# EAGLE design Register (EAGLE 9.4.2)
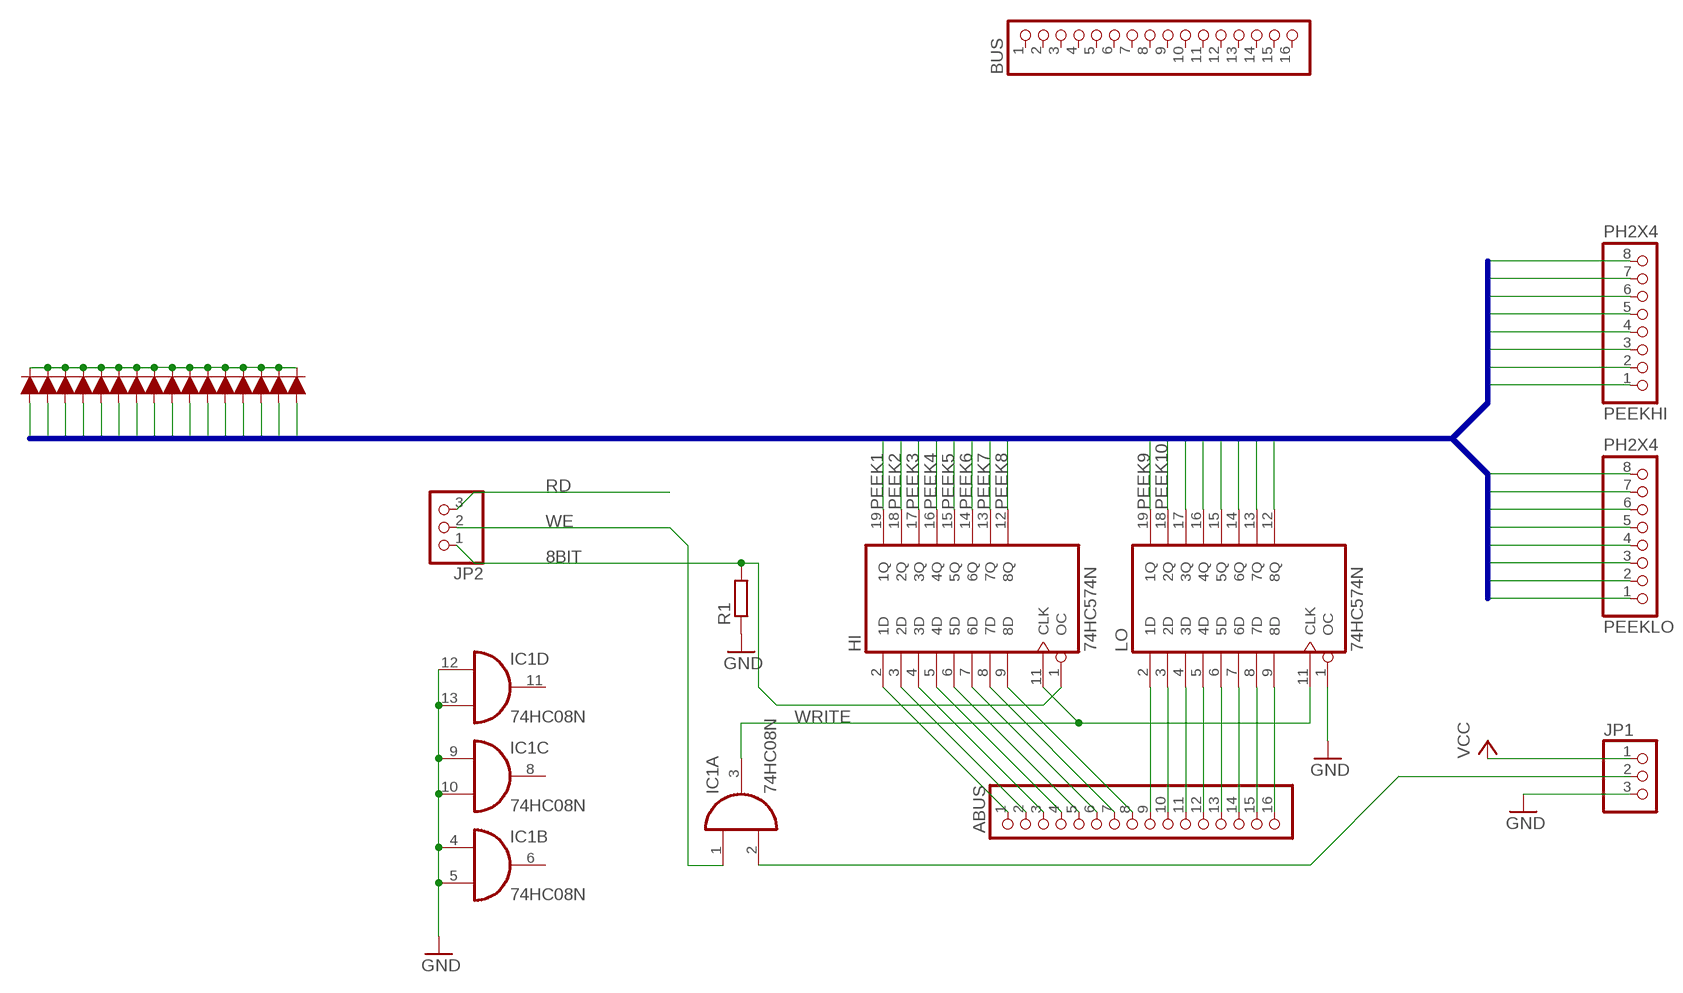
[diagram p0: schematic, sheet 1]

## Parts
ABUS  PINHD-1X16  [1X16]
BUS  PINHD-1X16  [1X16]
D1  200mA/100V/1V  DIODE-1N4148  [DIODE-1N4148]
D2  200mA/100V/1V  DIODE-1N4148  [DIODE-1N4148]
D3  200mA/100V/1V  DIODE-1N4148  [DIODE-1N4148]
D4  200mA/100V/1V  DIODE-1N4148  [DIODE-1N4148]
D5  200mA/100V/1V  DIODE-1N4148  [DIODE-1N4148]
D6  200mA/100V/1V  DIODE-1N4148  [DIODE-1N4148]
D7  200mA/100V/1V  DIODE-1N4148  [DIODE-1N4148]
D8  200mA/100V/1V  DIODE-1N4148  [DIODE-1N4148]
D9  200mA/100V/1V  DIODE-1N4148  [DIODE-1N4148]
D10  200mA/100V/1V  DIODE-1N4148  [DIODE-1N4148]
D11  200mA/100V/1V  DIODE-1N4148  [DIODE-1N4148]
D12  200mA/100V/1V  DIODE-1N4148  [DIODE-1N4148]
D13  200mA/100V/1V  DIODE-1N4148  [DIODE-1N4148]
D14  200mA/100V/1V  DIODE-1N4148  [DIODE-1N4148]
D15  200mA/100V/1V  DIODE-1N4148  [DIODE-1N4148]
D16  200mA/100V/1V  DIODE-1N4148  [DIODE-1N4148]
HI  74HC574N  [DIL20]
IC1  74HC08N  [DIL14]
JP1  PINHD-1X3  [1X03]
JP2  PINHD-1X3  [1X03]
LO  74HC574N  [DIL20]
PEEKHI  PH2X4  [2X04]
PEEKLO  PH2X4  [2X04]
R1  R-EU_0204/7  [0204/7]

## Nets
8BIT: HI.1(OC) JP2.1 R1.2
CLK: IC1.2(A:I1) JP1.2
GND: IC1.4(B:I0) IC1.5(B:I1) IC1.9(C:I0) IC1.10(C:I1) IC1.12(D:I0) IC1.13(D:I1) JP1.3 LO.1(OC) R1.1
N$1: ABUS.9 LO.2(1D)
N$2: ABUS.10 LO.3(2D)
N$3: ABUS.11 LO.4(3D)
N$4: ABUS.12 LO.5(4D)
N$5: ABUS.13 LO.6(5D)
N$6: ABUS.14 LO.7(6D)
N$7: ABUS.15 LO.8(7D)
N$8: ABUS.16 LO.9(8D)
N$9: ABUS.8 HI.9(8D)
N$10: ABUS.7 HI.8(7D)
N$11: ABUS.6 HI.7(6D)
N$12: ABUS.5 HI.6(5D)
N$13: ABUS.4 HI.5(4D)
N$14: ABUS.3 HI.4(3D)
N$15: ABUS.2 HI.3(2D)
N$16: ABUS.1 HI.2(1D)
N$17: D1.C D2.C D3.C D4.C D5.C D6.C D7.C D8.C D9.C D10.C D11.C D12.C D13.C D14.C D15.C D16.C
PEEK1: D16.A HI.19(1Q) PEEKHI.1
PEEK2: D15.A HI.18(2Q) PEEKHI.2
PEEK3: D14.A HI.17(3Q) PEEKHI.3
PEEK4: D1.A HI.16(4Q) PEEKHI.4
PEEK5: D13.A HI.15(5Q) PEEKHI.5
PEEK6: D2.A HI.14(6Q) PEEKHI.6
PEEK7: D12.A HI.13(7Q) PEEKHI.7
PEEK8: D3.A HI.12(8Q) PEEKHI.8
PEEK9: D11.A LO.19(1Q) PEEKLO.1
PEEK10: D4.A LO.18(2Q) PEEKLO.2
PEEK11: D10.A LO.17(3Q) PEEKLO.3
PEEK12: D5.A LO.16(4Q) PEEKLO.4
PEEK13: D9.A LO.14(6Q) LO.15(5Q) PEEKLO.5
PEEK14: D6.A PEEKLO.6
PEEK15: D7.A LO.13(7Q) PEEKLO.7
PEEK16: D8.A LO.12(8Q) PEEKLO.8
RD: JP2.3
VCC: JP1.1
WE: IC1.1(A:I0) JP2.2
WRITE: HI.11(CLK) IC1.3(A:O) LO.11(CLK)
Unconnected: BUS.1 BUS.2 BUS.3 BUS.4 BUS.5 BUS.6 BUS.7 BUS.8 BUS.9 BUS.10 BUS.11 BUS.12 BUS.13 BUS.14 BUS.15 BUS.16 IC1.6(B:O) IC1.8(C:O) IC1.11(D:O)

## Buses
PEEK[1..16]

## Power pins joined to a net without a drawn wire
GND: HI.10(GND) IC1.7(P:GND) LO.10(GND)
VCC: HI.20(VCC) IC1.14(P:VCC) LO.20(VCC)

## Library data of the parts
ABUS BUS = pinhead2:PINHD-1X16: PIN HEADER
D1-D16 = SparkFun-DiscreteSemi:DIODE: Diode These are standard reverse protection diodes and small signal diodes. SparkFun Products: SparkFun SparkPunk Sound Kit <https://www.sparkfun.com/products/11177> SparkFun ESP8266 Thing <https://www.sparkfun.com/products/13231>; PROD_ID: DIO-08378
HI LO = 74xx-eu:74*574: 8-bit D type FLIP FLOP bus driver
IC1 = 74xx-eu:74*08: Quad 2-input AND gate
JP1 = pinhead2:PINHD-1X3: PIN HEADER
JP2 = pinhead:PINHD-1X3: PIN HEADER
PEEKHI PEEKLO = pinhead2:PH2X4
R1 = rcl:R-EU_: RESISTOR, European symbol; SPICEPREFIX: R

## Board
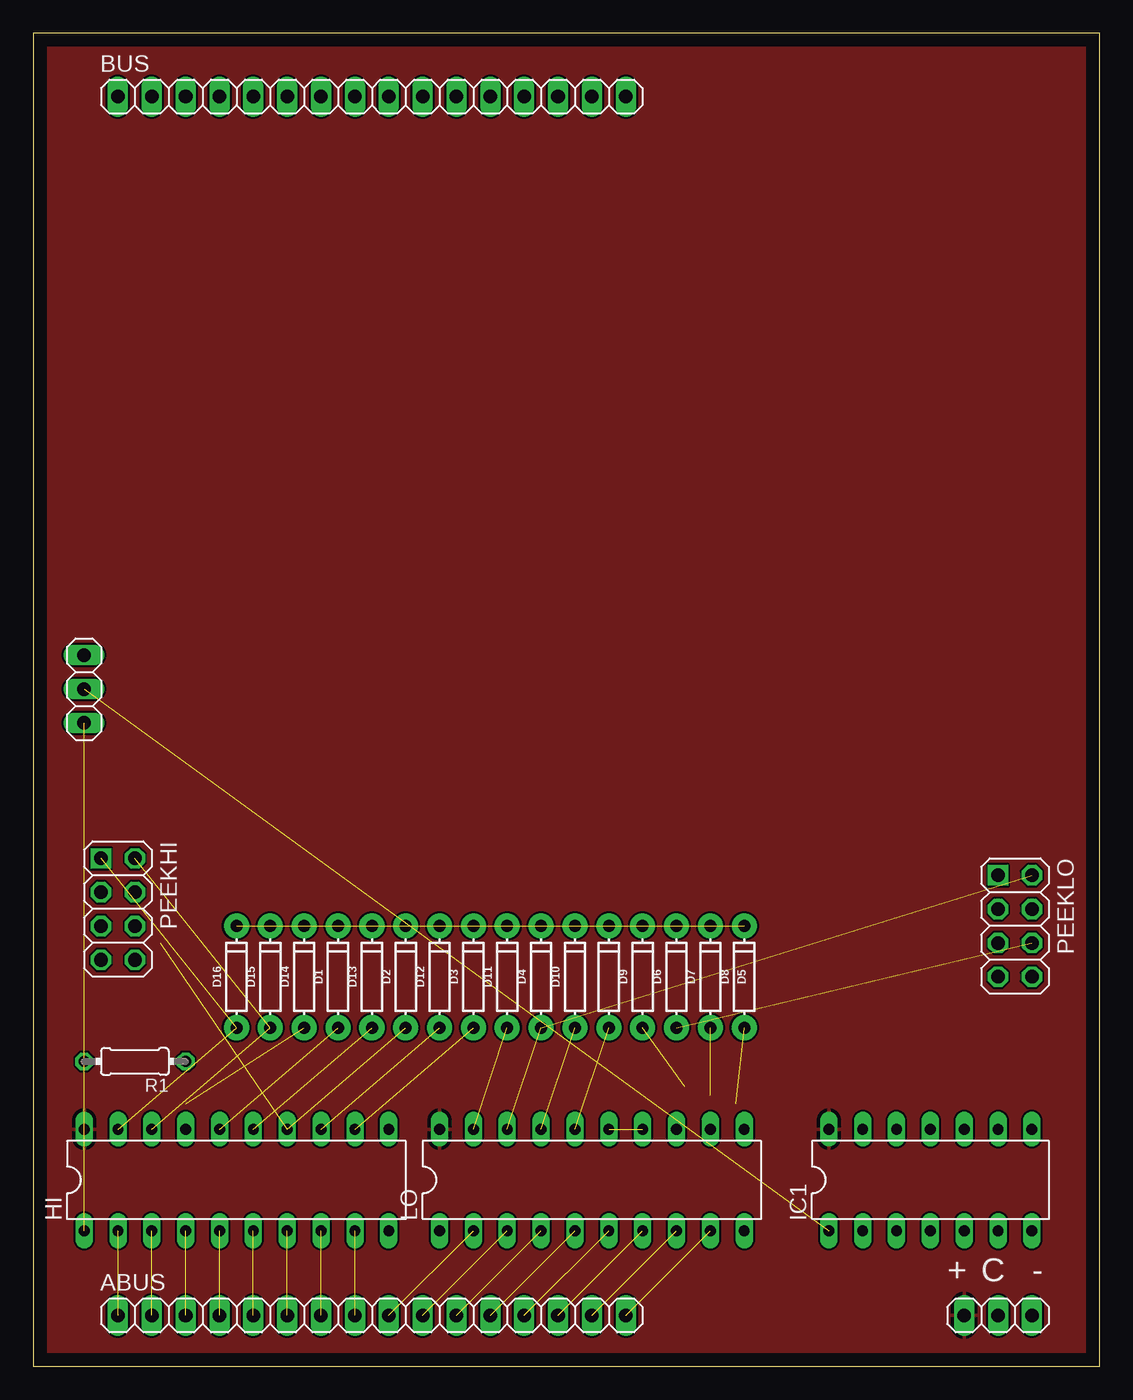
[diagram p1: board, top side]
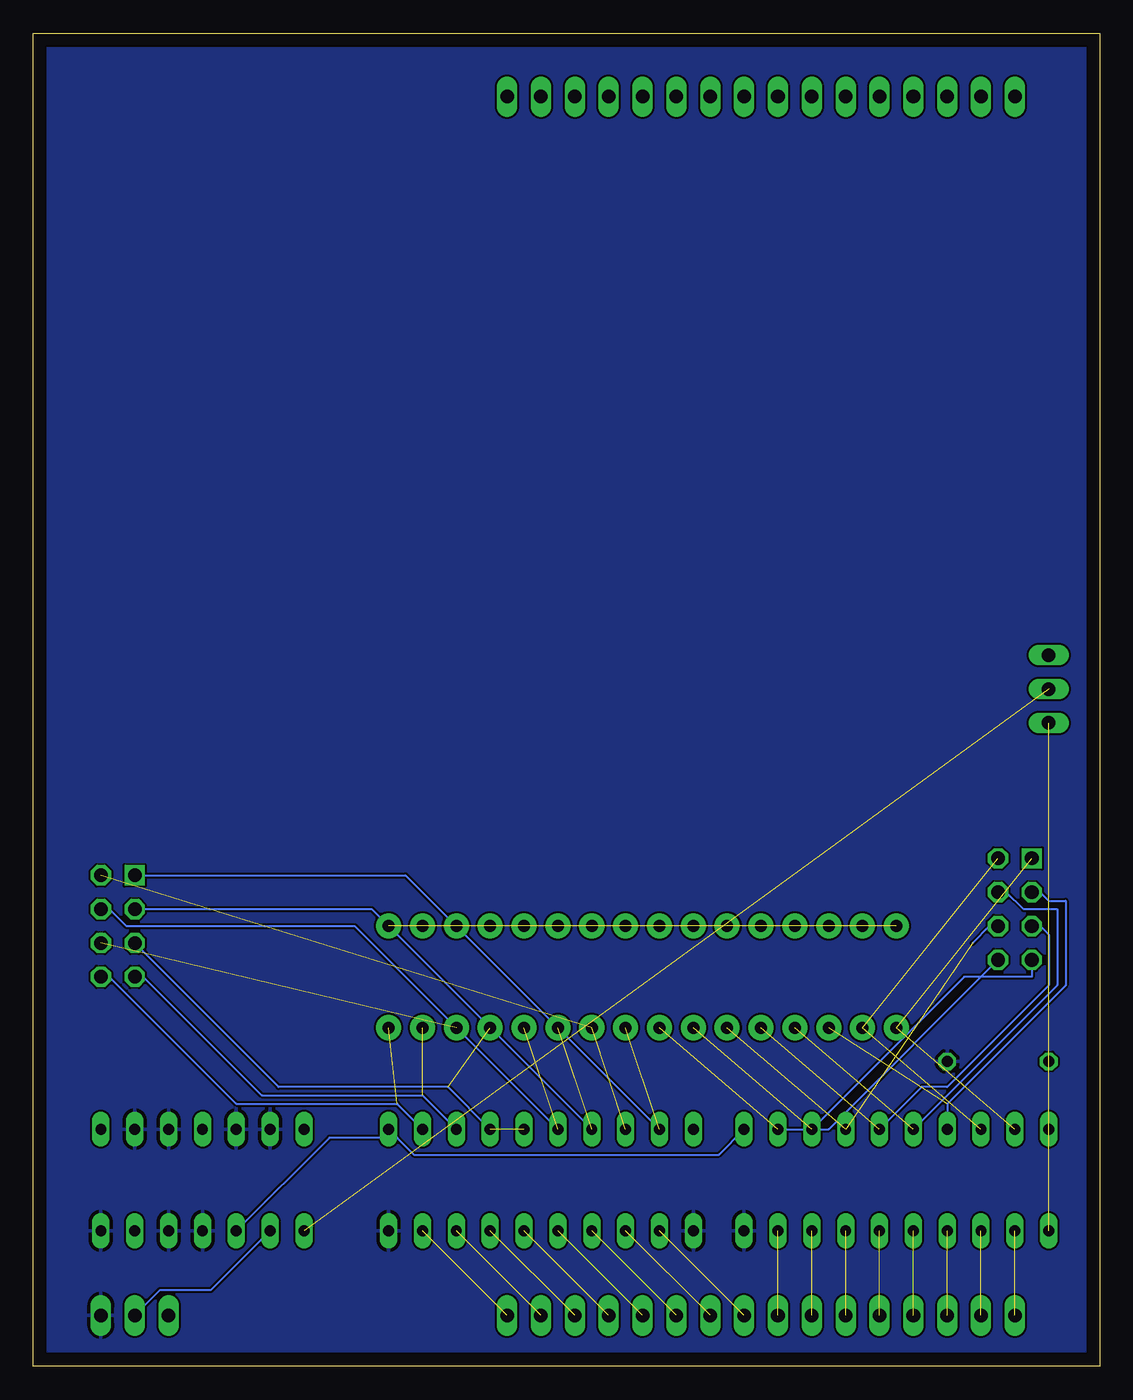
[diagram p2: board, bottom side, seen from below]

Size 80 x 100 mm. Coordinates in mm from the lower left corner, seen from the top.
Outline: 0,0 80,0 80,100 0,100 0,0
Copper layers (1*16): Top 0.035mm / dielectric 1.5mm / Bottom 0.035mm
Design rules "default": minimum track width 6mil, minimum drill 0.35mm, track to track 6mil, track to pad 6mil, pad to pad 6mil, via to via 6mil, smd to smd 6mil, copper to edge 40mil, drill to drill 6mil, minimum pad ring 10mil, minimum via ring 8mil, stop-mask expansion 4mil, vias tented up to drill 0mil, thermal gap 10mil

### Footprints (pad centres in the part's own frame; a part is rotated, then mirrored left to right if it is on the bottom)
1X16 = drill 1.016 long: 1 -19.05,0; 2 -16.51,0; 3 -13.97,0; 4 -11.43,0; 5 -8.89,0; 6 -6.35,0; 7 -3.81,0; 8 -1.27,0; 9 1.27,0; 10 3.81,0; 11 6.35,0; 12 8.89,0; 13 11.43,0; 14 13.97,0; 15 16.51,0; 16 19.05,0
DIODE-1N4148 = drill 0.9 pad 1.88: A -3.81,0; C 3.81,0
DIL20 = drill 0.813 long: 1 -11.43,-3.81; 2 -8.89,-3.81; 3 -6.35,-3.81; 4 -3.81,-3.81; 5 -1.27,-3.81; 6 1.27,-3.81; 7 3.81,-3.81; 8 6.35,-3.81; 9 8.89,-3.81; 10 11.43,-3.81; 11 11.43,3.81; 12 8.89,3.81; 13 6.35,3.81; 14 3.81,3.81; 15 1.27,3.81; 16 -1.27,3.81; 17 -3.81,3.81; 18 -6.35,3.81; 19 -8.89,3.81; 20 -11.43,3.81
DIL14 = drill 0.813 long: 1 -7.62,-3.81; 2 -5.08,-3.81; 3 -2.54,-3.81; 4 0,-3.81; 5 2.54,-3.81; 6 5.08,-3.81; 7 7.62,-3.81; 8 7.62,3.81; 9 5.08,3.81; 10 2.54,3.81; 11 0,3.81; 12 -2.54,3.81; 13 -5.08,3.81; 14 -7.62,3.81
1X03 = drill 1.016 long: 1 -2.54,0; 2 0,0; 3 2.54,0
2X04 = drill 1.016 square: 1 -3.81,-1.27 | drill 1.016 octagon: 2 -3.81,1.27; 3 -1.27,-1.27; 4 -1.27,1.27; 5 1.27,-1.27; 6 1.27,1.27; 7 3.81,-1.27; 8 3.81,1.27
0204/7 = drill 0.813 octagon: 1 -3.81,0; 2 3.81,0

### Placement (x,y rotation side)
ABUS  25.4,3.81 0 top
BUS  25.4,95.25 0 top
D1  22.86,29.21 90 top
D2  27.94,29.21 90 top
D3  33.02,29.21 90 top
D4  38.1,29.21 90 top
D5  43.18,29.21 90 top
D6  48.26,29.21 90 top
D7  50.8,29.21 90 top
D8  53.34,29.21 90 top
D9  45.72,29.21 90 top
D10  40.64,29.21 90 top
D11  35.56,29.21 90 top
D12  30.48,29.21 90 top
D13  25.4,29.21 90 top
D14  20.32,29.21 90 top
D15  17.78,29.21 90 top
D16  15.24,29.21 90 top
HI  15.24,13.97 0 top
IC1  67.31,13.97 0 top
JP1  72.39,3.81 0 top
JP2  3.81,50.8 90 top
LO  41.91,13.97 0 top
PEEKHI  6.35,34.29 270 top
PEEKLO  73.66,33.02 270 top
R1  7.62,22.86 180 top

### Tracks (layer width: path | path; a pad name or v marks a point on that pad's centre or on a via)
8BIT  (2 unrouted)
CLK
  Bottom 0.152: IC1.2 66.67,5.71 70.48,5.71 JP1.2
GND
  pour Bottom: -1.27,101.6 82.55,101.6 82.55,-2.54 80.01,-5.08 -1.27,-5.08 -5.08,-1.27 -5.08,97.79
N$1  (1 unrouted)
N$2  (1 unrouted)
N$3  (1 unrouted)
N$4  (1 unrouted)
N$5  (1 unrouted)
N$6  (1 unrouted)
N$7  (1 unrouted)
N$8  (1 unrouted)
N$9  (1 unrouted)
N$10  (1 unrouted)
N$11  (1 unrouted)
N$12  (1 unrouted)
N$13  (1 unrouted)
N$14  (1 unrouted)
N$15  (1 unrouted)
N$16  (1 unrouted)
N$17  (15 unrouted)
PEEK1  (2 unrouted)
PEEK2  (2 unrouted)
PEEK3  (1 unrouted)
  Bottom 0.152: HI.17 11.43,19.68 2.54,28.57 2.54,34.92 3.81,34.92 4.45,35.56 PEEKHI.3
PEEK4  (1 unrouted)
  Bottom 0.152: HI.16 3.17,28.57 3.17,34.29 5.71,34.29 6.99,35.56 PEEKHI.4
PEEK5  (1 unrouted)
  Bottom 0.152: HI.15 13.34,20.95 11.43,20.95 3.81,28.57 3.81,32.38 4.45,33.02 PEEKHI.5
PEEK6  (2 unrouted)
  Bottom 0.152: 9.53,31.75 8.26,33.02 PEEKHI.6
PEEK7  (1 unrouted)
  Bottom 0.152: HI.13 10.16,29.21 5.08,29.21 PEEKHI.7
PEEK8  (1 unrouted)
  Bottom 0.152: HI.12 20.32,17.78 PEEKHI.8
PEEK9  (1 unrouted)
  Bottom 0.152: LO.19 52.07,36.83 PEEKLO.1
PEEK10  (2 unrouted)
PEEK11  (1 unrouted)
  Bottom 0.152: LO.17 54.61,34.29 PEEKLO.3
PEEK12  (1 unrouted)
  Bottom 0.152: LO.16 55.88,33.02 73.03,33.02 74.3,34.29 PEEKLO.4
PEEK13  (2 unrouted)
  Bottom 0.152: PEEKLO.5 61.59,20.95 48.9,20.95 LO.14
PEEK14  (1 unrouted)
PEEK15  (1 unrouted)
  Bottom 0.152: LO.13 50.8,20.32 62.87,20.32 71.75,29.21 PEEKLO.7
PEEK16  (1 unrouted)
  Bottom 0.152: LO.12 52.7,19.68 64.77,19.68 74.3,29.21 PEEKLO.8
VCC
  pour Top: -2.54,106.68 92.71,106.68 92.71,-8.89 -6.35,-8.89 -6.35,106.68
WE  (1 unrouted)
WRITE
  Bottom 0.152: HI.11 28.57,15.88 51.44,15.88 52.7,17.14 | IC1.3 57.78,17.14 52.7,17.14 | 52.7,17.14 LO.11

### Text on the board
tNames: + | C | -